# EAGLE schematic lora-tx (EAGLE 7.7.0)
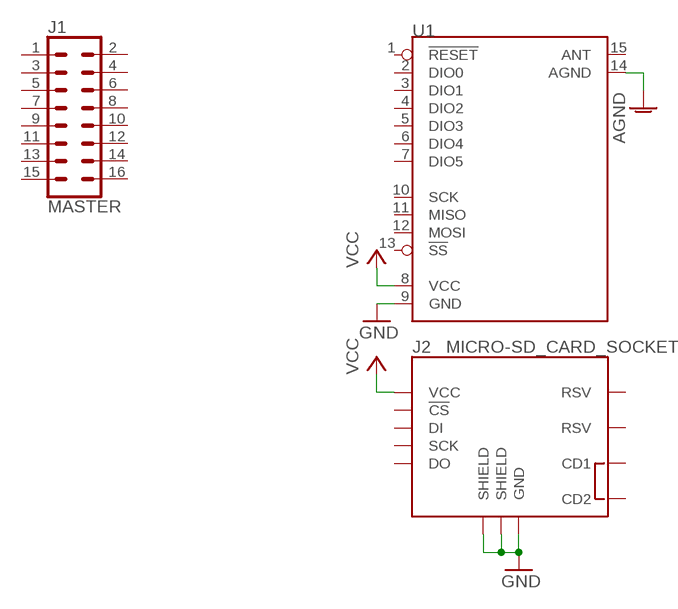
[diagram p0: schematic, sheet 1]

## Parts
J1  MASTER  CONN_08X2  [2X8]
J2  MICRO-SD_CARD_SOCKET  [MICRO-SD-SOCKET]
U1  DRF1278F  [DRF1278F]

## Nets
AGND: U1.14(AGND)
GND: J2.GND J2.GND1(SHIELD) J2.GND3(SHIELD) U1.9(GND)
VCC: J2.VCC U1.8(VCC)
Unconnected: J1.1 J1.2 J1.3 J1.4 J1.5 J1.6 J1.7 J1.8 J1.9 J1.10 J1.11 J1.12 J1.13 J1.14 J1.15 J1.16 J2.CD1 J2.CD2 J2.CS(!CS) J2.DI J2.DO J2.RSV1(RSV) J2.RSV2(RSV) J2.SCLK(SCK) U1.1(!RESET!) U1.2(DIO0) U1.3(DIO1) U1.4(DIO2) U1.5(DIO3) U1.6(DIO4) U1.7(DIO5) U1.10(SCK) U1.11(MISO) U1.12(MOSI) U1.13(!SS!) U1.15(ANT)

## Library data of the parts
J1 = SparkFun-Connectors:CONN_08X2: Multi connection point. Often used as Generic Header-pin footprint for 0.1 inch spaced/style header connections You can populate with any combo of single row headers, but if you'd like an exact match, check this: Header - 2x8 (Male, 0.1") <https://www.sparkfun.com/products/13156> (PRT-13156) On any of the 0.1 inch spaced packages, you can populate with these: Break Away Headers - Straight <https://www.sparkfun.com/products/116> (PRT-00116) Break Away Male Headers - Right Angle <https://www.sparkfun.com/products/553> (PRT-00553) Female Headers <https://www.sparkfun.com/products/115> (PRT-00115) Break Away Headers - Machine Pin <https://www.sparkfun.com/products/117> (PRT-00117) Break Away Female Headers - Swiss Machine Pin <https://www.sparkfun.com/products/743> (PRT-00743)
J2 = SparkFun-Connectors:MICRO-SD_CARD_SOCKET: microSD Socket for Transflash Push-push type µSD socket. tDoc lines correctly indicate media card edge positions when inserting (unlocked, locked, depressed). NOTE: CD1 and CD2 are connected internally, and the default detect state of the socket is detect pin to ground. SparkFun Products: WAV Trigger <https://www.sparkfun.com/products/13660> CAN-Bus Shield <https://www.sparkfun.com/products/13262> SparkFun Level Shifing microSD Breakout <https://www.sparkfun.com/products/13743>; PROD_ID: CONN-07820; SF_ID: PRT-00127
U1 = HAB:DRF1278F: DRF1278F Module for SX1278 LoRA radio